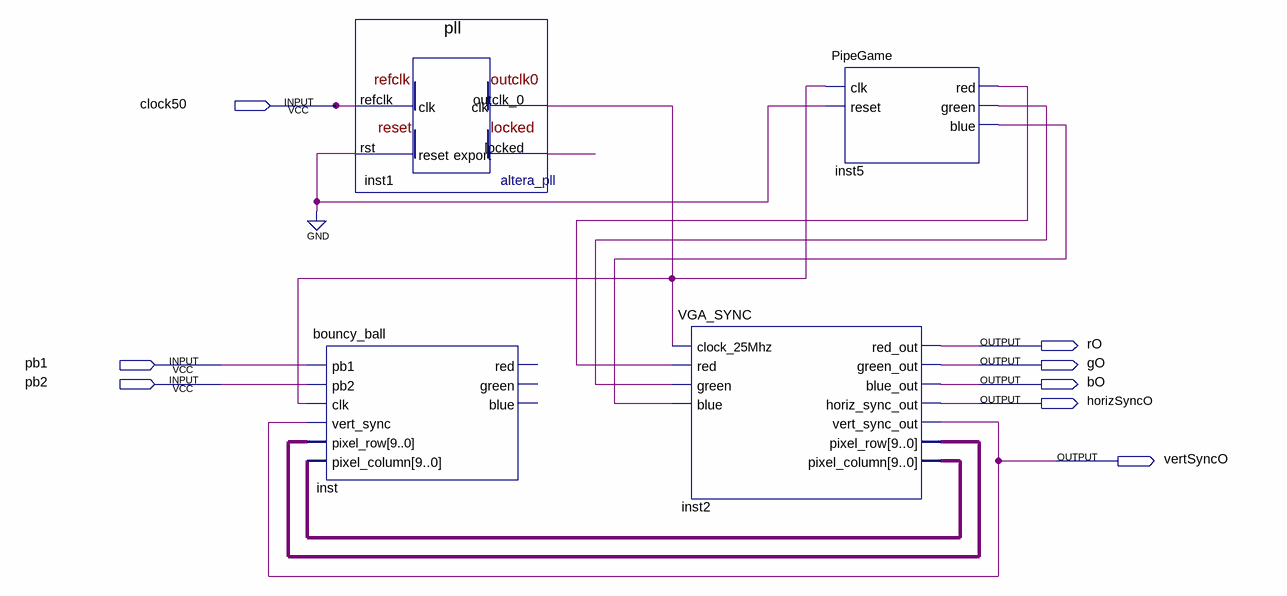
[diagram p0: schematic sheet]
// Quartus schematic main.bdf as structural Verilog: 4 symbols, 8 pins
module main (
  input  clock50,
  input  pb1,
  input  pb2,
  output rO,
  output gO,
  output bO,
  output horizSyncO,
  output vertSyncO
);

  wire inst1_locked, inst1_outclk_0, inst5_blue, inst5_green, inst5_red;
  wire [9:0] inst2_pixel_column, inst2_pixel_row;

  bouncy_ball inst (
    .pb1(pb1), .pb2(pb2), .clk(inst1_outclk_0), .vert_sync(vertSyncO), .pixel_row(inst2_pixel_row),
    .pixel_column(inst2_pixel_column));  // open: red, green, blue
  pll inst1 (.refclk(clock50), .rst(1'b0), .outclk_0(inst1_outclk_0), .locked(inst1_locked));
  VGA_SYNC inst2 (
    .clock_25Mhz(inst1_outclk_0), .red(inst5_red), .green(inst5_green), .blue(inst5_blue), .red_out(rO),
    .green_out(gO), .blue_out(bO), .horiz_sync_out(horizSyncO), .vert_sync_out(vertSyncO),
    .pixel_row(inst2_pixel_row), .pixel_column(inst2_pixel_column));
  PipeGame inst5 (.clk(inst1_outclk_0), .reset(1'b0), .red(inst5_red), .green(inst5_green), .blue(inst5_blue));
endmodule
